# Altium schematic sheet 00-multimodal-coversheet.SchDoc
size A4; SheetNumber: 1; SheetTotal: 11
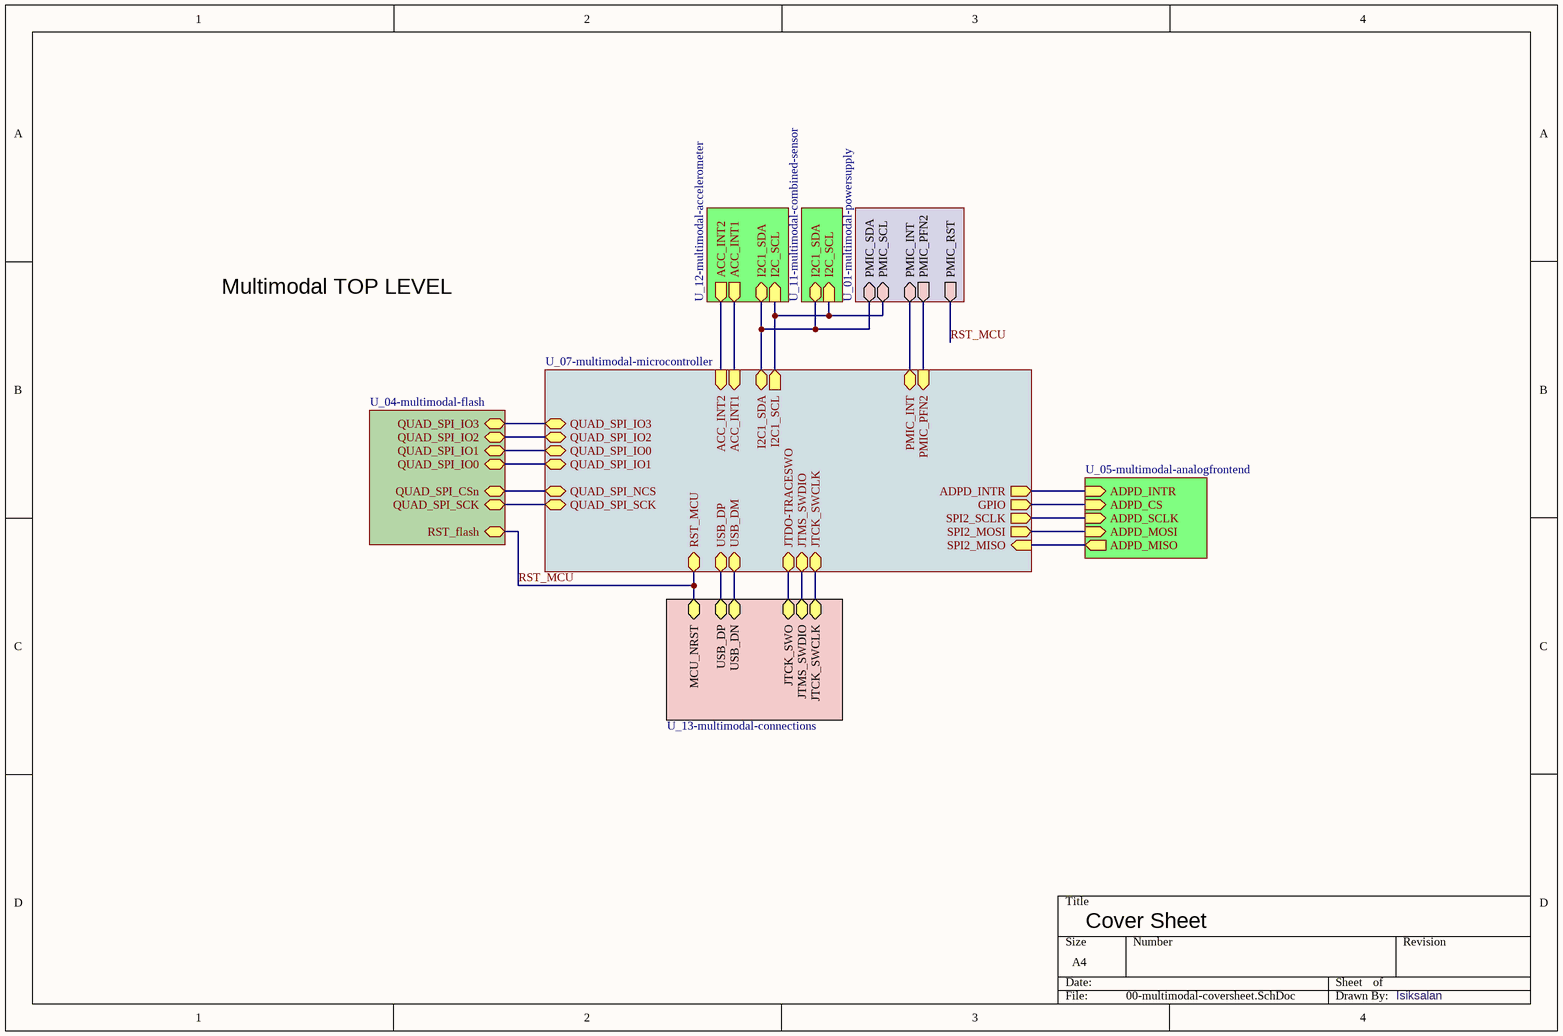
[diagram p0: 00-multimodal-coversheet.SchDoc]

## Sub-sheets
U_01-multimodal-powersupply = 01-multimodal-powersupply.SchDoc: PMIC_RST (out), PMIC_SDA (bidir), PMIC_SCL (bidir), PMIC_PFN2 (out), PMIC_INT (bidir)
U_04-multimodal-flash = 04-multimodal-flash.SchDoc: QUAD_SPI_CSn (bidir), QUAD_SPI_SCK (bidir), QUAD_SPI_IO0 (bidir), QUAD_SPI_IO1 (bidir), QUAD_SPI_IO2 (bidir), QUAD_SPI_IO3 (bidir), RST_flash (bidir)
U_05-multimodal-analogfrontend = 05-multimodal-analogfrontend.SchDoc: ADPD_INTR (in), ADPD_CS (in), ADPD_SCLK (in), ADPD_MISO (out), ADPD_MOSI (in)
U_07-multimodal-microcontroller = 07-multimodal-microcontroller.SchDoc: QUAD_SPI_IO3 (bidir), QUAD_SPI_IO2 (bidir), QUAD_SPI_IO0 (bidir), QUAD_SPI_IO1 (bidir), SPI2_MOSI (out), SPI2_MISO (in), SPI2_SCLK (out), I2C1_SCL (out), I2C1_SDA (bidir), USB_DP (bidir), USB_DM (bidir), QUAD_SPI_NCS (bidir), QUAD_SPI_SCK (bidir), JTDO-TRACESWO (bidir), JTCK_SWCLK (bidir), JTMS_SWDIO (bidir), RST_MCU (bidir), GPIO (out), ADPD_INTR (out), ACC_INT2 (in), ACC_INT1 (in), PMIC_PFN2 (in), PMIC_INT (bidir)
U_11-multimodal-combined-sensor = 11-multimodal-combined-sensor.SchDoc: I2C1_SDA (bidir), I2C_SCL (in)
U_12-multimodal-accelerometer = 12-multimodal-accelerometer.SchDoc: ACC_INT1 (out), ACC_INT2 (out), I2C1_SDA (bidir), I2C_SCL (in)
U_13-multimodal-connections = 13-multimodal-connections.SchDoc: JTCK_SWCLK (bidir), USB_DN (bidir), USB_DP (bidir), JTMS_SWDIO (bidir), MCU_NRST (bidir), JTCK_SWO (bidir)

## Nets
RST_MCU: sheet U_13-multimodal-connections/MCU_NRST, sheet U_04-multimodal-flash/RST_flash, sheet U_01-multimodal-powersupply/PMIC_RST, sheet U_07-multimodal-microcontroller/RST_MCU
(unnamed): sheet U_05-multimodal-analogfrontend/ADPD_INTR, sheet U_07-multimodal-microcontroller/ADPD_INTR
(unnamed): sheet U_05-multimodal-analogfrontend/ADPD_CS, sheet U_07-multimodal-microcontroller/GPIO
(unnamed): sheet U_05-multimodal-analogfrontend/ADPD_SCLK, sheet U_07-multimodal-microcontroller/SPI2_SCLK
(unnamed): sheet U_05-multimodal-analogfrontend/ADPD_MISO, sheet U_07-multimodal-microcontroller/SPI2_MISO
(unnamed): sheet U_05-multimodal-analogfrontend/ADPD_MOSI, sheet U_07-multimodal-microcontroller/SPI2_MOSI
(unnamed): sheet U_13-multimodal-connections/JTCK_SWCLK, sheet U_07-multimodal-microcontroller/JTCK_SWCLK
(unnamed): sheet U_13-multimodal-connections/USB_DN, sheet U_07-multimodal-microcontroller/USB_DM
(unnamed): sheet U_13-multimodal-connections/USB_DP, sheet U_07-multimodal-microcontroller/USB_DP
(unnamed): sheet U_13-multimodal-connections/JTMS_SWDIO, sheet U_07-multimodal-microcontroller/JTMS_SWDIO
(unnamed): sheet U_13-multimodal-connections/JTCK_SWO, sheet U_07-multimodal-microcontroller/JTDO-TRACESWO
(unnamed): sheet U_12-multimodal-accelerometer/ACC_INT1, sheet U_07-multimodal-microcontroller/ACC_INT1
(unnamed): sheet U_12-multimodal-accelerometer/ACC_INT2, sheet U_07-multimodal-microcontroller/ACC_INT2
(unnamed): sheet U_12-multimodal-accelerometer/I2C1_SDA, sheet U_11-multimodal-combined-sensor/I2C1_SDA, sheet U_01-multimodal-powersupply/PMIC_SDA, sheet U_07-multimodal-microcontroller/I2C1_SDA
(unnamed): sheet U_12-multimodal-accelerometer/I2C_SCL, sheet U_11-multimodal-combined-sensor/I2C_SCL, sheet U_01-multimodal-powersupply/PMIC_SCL, sheet U_07-multimodal-microcontroller/I2C1_SCL
(unnamed): sheet U_04-multimodal-flash/QUAD_SPI_CSn, sheet U_07-multimodal-microcontroller/QUAD_SPI_NCS
(unnamed): sheet U_04-multimodal-flash/QUAD_SPI_SCK, sheet U_07-multimodal-microcontroller/QUAD_SPI_SCK
(unnamed): sheet U_04-multimodal-flash/QUAD_SPI_IO0, sheet U_07-multimodal-microcontroller/QUAD_SPI_IO1
(unnamed): sheet U_04-multimodal-flash/QUAD_SPI_IO1, sheet U_07-multimodal-microcontroller/QUAD_SPI_IO0
(unnamed): sheet U_04-multimodal-flash/QUAD_SPI_IO2, sheet U_07-multimodal-microcontroller/QUAD_SPI_IO2
(unnamed): sheet U_04-multimodal-flash/QUAD_SPI_IO3, sheet U_07-multimodal-microcontroller/QUAD_SPI_IO3
(unnamed): sheet U_01-multimodal-powersupply/PMIC_PFN2, sheet U_07-multimodal-microcontroller/PMIC_PFN2
(unnamed): sheet U_01-multimodal-powersupply/PMIC_INT, sheet U_07-multimodal-microcontroller/PMIC_INT

## Notes on the sheet
- Multimodal TOP LEVEL
- Cover Sheet
- Isiksalan